# Altium schematic sheet Sheet2.SchDoc
size A4
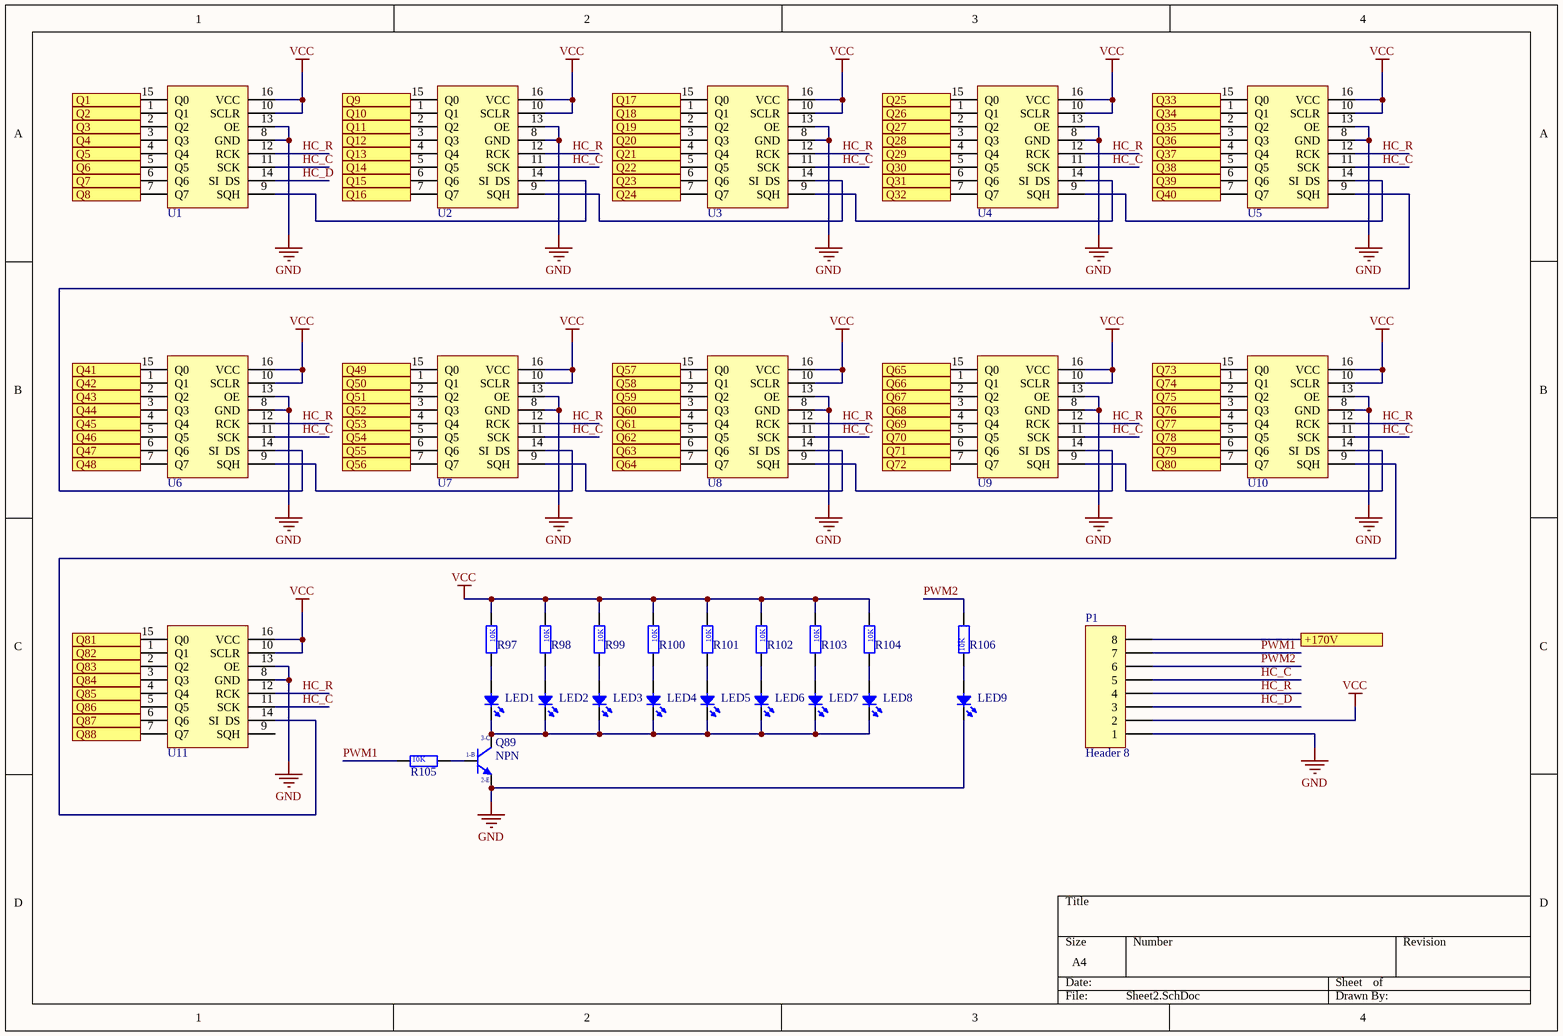
[diagram p0: Sheet2.SchDoc]

## Parts
LED1  LED  [0805D]  (value not drawn)
LED2  LED  [0805D]  (value not drawn)
LED3  LED  [0805D]  (value not drawn)
LED4  LED  [0805D]  (value not drawn)
LED5  LED  [0805D]  (value not drawn)
LED6  LED  [0805D]  (value not drawn)
LED7  LED  [0805D]  (value not drawn)
LED8  LED  [0805D]  (value not drawn)
LED9  LED  [0805D]  (value not drawn)
P1  Header 8  [HDR1X8]
Q89  NPN  [SOT-23]
R97  value 10K  [0805]  (hidden comment: R)
R98  value 10K  [0805]  (hidden comment: R)
R99  value 10K  [0805]  (hidden comment: R)
R100  value 10K  [0805]  (hidden comment: R)
R101  value 10K  [0805]  (hidden comment: R)
R102  value 10K  [0805]  (hidden comment: R)
R103  value 10K  [0805]  (hidden comment: R)
R104  value 10K  [0805]  (hidden comment: R)
R105  value 10K  [0805]  (hidden comment: R)
R106  value 10K  [0805]  (hidden comment: R)
U1  74HC595  [SOP-16]  (value not drawn)
U2  74HC595  [SOP-16]  (value not drawn)
U3  74HC595  [SOP-16]  (value not drawn)
U4  74HC595  [SOP-16]  (value not drawn)
U5  74HC595  [SOP-16]  (value not drawn)
U6  74HC595  [SOP-16]  (value not drawn)
U7  74HC595  [SOP-16]  (value not drawn)
U8  74HC595  [SOP-16]  (value not drawn)
U9  74HC595  [SOP-16]  (value not drawn)
U10  74HC595  [SOP-16]  (value not drawn)
U11  74HC595  [SOP-16]  (value not drawn)

## Ports
+170V, Q1, Q2, Q3, Q4, Q5, Q6, Q7, Q8, Q9, Q10, Q11, Q12, Q13, Q14, Q15, Q16, Q17, Q18, Q19, Q20, Q21, Q22, Q23, Q24, Q25, Q26, Q27, Q28, Q29, Q30, Q31, Q32, Q33, Q34, Q35, Q36, Q37, Q38, Q39, Q40, Q41, Q42, Q43, Q44, Q45, Q46, Q47, Q48, Q49, Q50, Q51, Q52, Q53, Q54, Q55, Q56, Q57, Q58, Q59, Q60, Q61, Q62, Q63, Q64, Q65, Q66, Q67, Q68, Q69, Q70, Q71, Q72, Q73, Q74, Q75, Q76, Q77, Q78, Q79, Q80, Q81, Q82, Q83, Q84, Q85, Q86, Q87, Q88

## Nets
GND: LED9.2(K) P1.1 Q89.2(E) U1.8(GND) U1.13(OE) U2.8(GND) U2.13(OE) U3.8(GND) U3.13(OE) U4.8(GND) U4.13(OE) U5.8(GND) U5.13(OE) U6.8(GND) U6.13(OE) U7.8(GND) U7.13(OE) U8.8(GND) U8.13(OE) U9.8(GND) U9.13(OE) U10.8(GND) U10.13(OE) U11.8(GND) U11.13(OE)
VCC: P1.2 R97.1 R98.1 R99.1 R100.1 R101.1 R102.1 R103.1 R104.1 U1.10(SCLR) U1.16(VCC) U2.10(SCLR) U2.16(VCC) U3.10(SCLR) U3.16(VCC) U4.10(SCLR) U4.16(VCC) U5.10(SCLR) U5.16(VCC) U6.10(SCLR) U6.16(VCC) U7.10(SCLR) U7.16(VCC) U8.10(SCLR) U8.16(VCC) U9.10(SCLR) U9.16(VCC) U10.10(SCLR) U10.16(VCC) U11.10(SCLR) U11.16(VCC)
+170V: P1.8 ; port +170V
HC_C: P1.5 U1.11(SCK) U2.11(SCK) U3.11(SCK) U4.11(SCK) U5.11(SCK) U6.11(SCK) U7.11(SCK) U8.11(SCK) U9.11(SCK) U10.11(SCK) U11.11(SCK)
HC_D: P1.3 U1.14(SI__DS)
HC_R: P1.4 U1.12(RCK) U2.12(RCK) U3.12(RCK) U4.12(RCK) U5.12(RCK) U6.12(RCK) U7.12(RCK) U8.12(RCK) U9.12(RCK) U10.12(RCK) U11.12(RCK)
PWM1: P1.7 R105.1
PWM2: P1.6 R106.2
Q1: U1.15(Q0) ; port Q1
Q2: U1.1(Q1) ; port Q2
Q3: U1.2(Q2) ; port Q3
Q4: U1.3(Q3) ; port Q4
Q5: U1.4(Q4) ; port Q5
Q6: U1.5(Q5) ; port Q6
Q7: U1.6(Q6) ; port Q7
Q8: U1.7(Q7) ; port Q8
Q9: U2.15(Q0) ; port Q9
Q10: U2.1(Q1) ; port Q10
Q11: U2.2(Q2) ; port Q11
Q12: U2.3(Q3) ; port Q12
Q13: U2.4(Q4) ; port Q13
Q14: U2.5(Q5) ; port Q14
Q15: U2.6(Q6) ; port Q15
Q16: U2.7(Q7) ; port Q16
Q17: U3.15(Q0) ; port Q17
Q18: U3.1(Q1) ; port Q18
Q19: U3.2(Q2) ; port Q19
Q20: U3.3(Q3) ; port Q20
Q21: U3.4(Q4) ; port Q21
Q22: U3.5(Q5) ; port Q22
Q23: U3.6(Q6) ; port Q23
Q24: U3.7(Q7) ; port Q24
Q25: U4.15(Q0) ; port Q25
Q26: U4.1(Q1) ; port Q26
Q27: U4.2(Q2) ; port Q27
Q28: U4.3(Q3) ; port Q28
Q29: U4.4(Q4) ; port Q29
Q30: U4.5(Q5) ; port Q30
Q31: U4.6(Q6) ; port Q31
Q32: U4.7(Q7) ; port Q32
Q33: U5.15(Q0) ; port Q33
Q34: U5.1(Q1) ; port Q34
Q35: U5.2(Q2) ; port Q35
Q36: U5.3(Q3) ; port Q36
Q37: U5.4(Q4) ; port Q37
Q38: U5.5(Q5) ; port Q38
Q39: U5.6(Q6) ; port Q39
Q40: U5.7(Q7) ; port Q40
Q41: U6.15(Q0) ; port Q41
Q42: U6.1(Q1) ; port Q42
Q43: U6.2(Q2) ; port Q43
Q44: U6.3(Q3) ; port Q44
Q45: U6.4(Q4) ; port Q45
Q46: U6.5(Q5) ; port Q46
Q47: U6.6(Q6) ; port Q47
Q48: U6.7(Q7) ; port Q48
Q49: U7.15(Q0) ; port Q49
Q50: U7.1(Q1) ; port Q50
Q51: U7.2(Q2) ; port Q51
Q52: U7.3(Q3) ; port Q52
Q53: U7.4(Q4) ; port Q53
Q54: U7.5(Q5) ; port Q54
Q55: U7.6(Q6) ; port Q55
Q56: U7.7(Q7) ; port Q56
Q57: U8.15(Q0) ; port Q57
Q58: U8.1(Q1) ; port Q58
Q59: U8.2(Q2) ; port Q59
Q60: U8.3(Q3) ; port Q60
Q61: U8.4(Q4) ; port Q61
Q62: U8.5(Q5) ; port Q62
Q63: U8.6(Q6) ; port Q63
Q64: U8.7(Q7) ; port Q64
Q65: U9.15(Q0) ; port Q65
Q66: U9.1(Q1) ; port Q66
Q67: U9.2(Q2) ; port Q67
Q68: U9.3(Q3) ; port Q68
Q69: U9.4(Q4) ; port Q69
Q70: U9.5(Q5) ; port Q70
Q71: U9.6(Q6) ; port Q71
Q72: U9.7(Q7) ; port Q72
Q73: U10.15(Q0) ; port Q73
Q74: U10.1(Q1) ; port Q74
Q75: U10.2(Q2) ; port Q75
Q76: U10.3(Q3) ; port Q76
Q77: U10.4(Q4) ; port Q77
Q78: U10.5(Q5) ; port Q78
Q79: U10.6(Q6) ; port Q79
Q80: U10.7(Q7) ; port Q80
Q81: U11.15(Q0) ; port Q81
Q82: U11.1(Q1) ; port Q82
Q83: U11.2(Q2) ; port Q83
Q84: U11.3(Q3) ; port Q84
Q85: U11.4(Q4) ; port Q85
Q86: U11.5(Q5) ; port Q86
Q87: U11.6(Q6) ; port Q87
Q88: U11.7(Q7) ; port Q88
NetLED1_1: LED1.1(A) R97.2
NetLED1_2: LED1.2(K) LED2.2(K) LED3.2(K) LED4.2(K) LED5.2(K) LED6.2(K) LED7.2(K) LED8.2(K) Q89.3(C)
NetLED2_1: LED2.1(A) R98.2
NetLED3_1: LED3.1(A) R99.2
NetLED4_1: LED4.1(A) R100.2
NetLED5_1: LED5.1(A) R101.2
NetLED6_1: LED6.1(A) R102.2
NetLED7_1: LED7.1(A) R103.2
NetLED8_1: LED8.1(A) R104.2
NetLED9_1: LED9.1(A) R106.1
NetQ89_1: Q89.1(B) R105.2
NetU1_9: U1.9(SQH) U2.14(SI__DS)
NetU2_9: U2.9(SQH) U3.14(SI__DS)
NetU3_9: U3.9(SQH) U4.14(SI__DS)
NetU4_9: U4.9(SQH) U5.14(SI__DS)
NetU5_9: U5.9(SQH) U6.14(SI__DS)
NetU6_9: U6.9(SQH) U7.14(SI__DS)
NetU7_9: U7.9(SQH) U8.14(SI__DS)
NetU8_9: U8.9(SQH) U9.14(SI__DS)
NetU9_9: U9.9(SQH) U10.14(SI__DS)
NetU10_9: U10.9(SQH) U11.14(SI__DS)

Not connected (* = marked no-connect by the designer): U11 9(SQH)

## Notes on the sheet
- (in symbol NPN-S8050-SOT-23) 3-C; 1-B; 2-E

## Library data of the parts
P1 = Header 8: Header, 8-Pin; LatestRevisionDate: 17-Jul-2002; LatestRevisionNote: Re-released for DXP Platform.; Publisher: Altium Limited
Q89 = NPN-S8050-SOT-23
U1-U11 = 74HC595_1
LED1-LED9 = LED: Published: 8-Jun-2000; LatestRevisionDate: 08-Jul-2005; LatestRevisionNote: Mech Layer 1 removed.; PackageReference: LED-0; Publisher: Altium Limited; PackageDescription: LED; 2 Leads